# Altium schematic sheet Sheet1.SchDoc
size A4
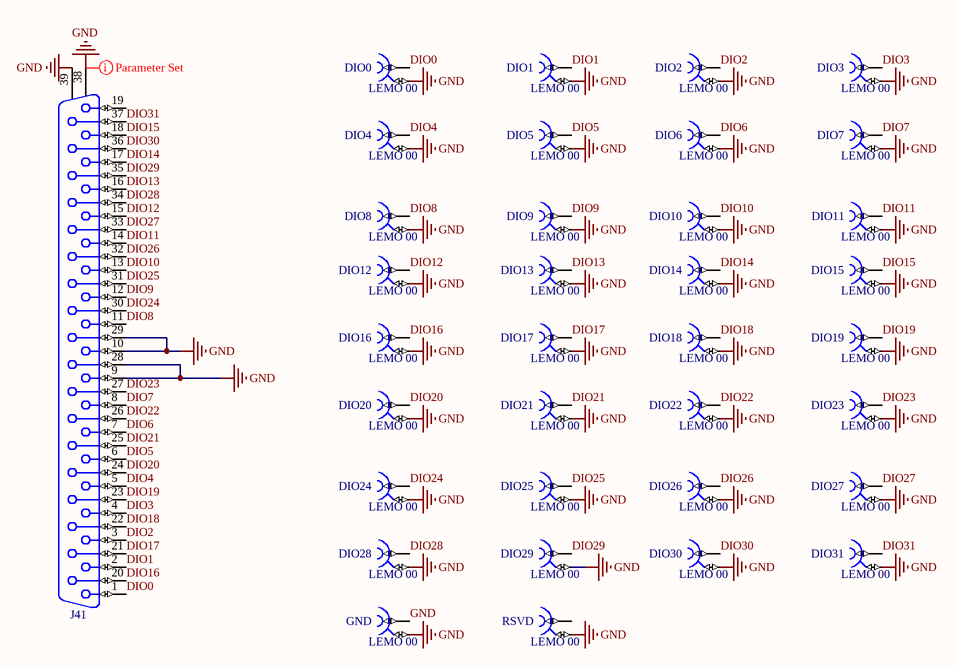
[diagram p0: Sheet1.SchDoc]

## Parts
DIO0  LEMO 00  [LEMO_EPA.00.250.NTN]
DIO1  LEMO 00  [LEMO_EPA.00.250.NTN]
DIO2  LEMO 00  [LEMO_EPA.00.250.NTN]
DIO3  LEMO 00  [LEMO_EPA.00.250.NTN]
DIO4  LEMO 00  [LEMO_EPA.00.250.NTN]
DIO5  LEMO 00  [LEMO_EPA.00.250.NTN]
DIO6  LEMO 00  [LEMO_EPA.00.250.NTN]
DIO7  LEMO 00  [LEMO_EPA.00.250.NTN]
DIO8  LEMO 00  [LEMO_EPA.00.250.NTN]
DIO9  LEMO 00  [LEMO_EPA.00.250.NTN]
DIO10  LEMO 00  [LEMO_EPA.00.250.NTN]
DIO11  LEMO 00  [LEMO_EPA.00.250.NTN]
DIO12  LEMO 00  [LEMO_EPA.00.250.NTN]
DIO13  LEMO 00  [LEMO_EPA.00.250.NTN]
DIO14  LEMO 00  [LEMO_EPA.00.250.NTN]
DIO15  LEMO 00  [LEMO_EPA.00.250.NTN]
DIO16  LEMO 00  [LEMO_EPA.00.250.NTN]
DIO17  LEMO 00  [LEMO_EPA.00.250.NTN]
DIO18  LEMO 00  [LEMO_EPA.00.250.NTN]
DIO19  LEMO 00  [LEMO_EPA.00.250.NTN]
DIO20  LEMO 00  [LEMO_EPA.00.250.NTN]
DIO21  LEMO 00  [LEMO_EPA.00.250.NTN]
DIO22  LEMO 00  [LEMO_EPA.00.250.NTN]
DIO23  LEMO 00  [LEMO_EPA.00.250.NTN]
DIO24  LEMO 00  [LEMO_EPA.00.250.NTN]
DIO25  LEMO 00  [LEMO_EPA.00.250.NTN]
DIO26  LEMO 00  [LEMO_EPA.00.250.NTN]
DIO27  LEMO 00  [LEMO_EPA.00.250.NTN]
DIO28  LEMO 00  [LEMO_EPA.00.250.NTN]
DIO29  LEMO 00  [LEMO_EPA.00.250.NTN]
DIO30  LEMO 00  [LEMO_EPA.00.250.NTN]
DIO31  LEMO 00  [LEMO_EPA.00.250.NTN]
GND  LEMO 00  [LEMO_EPA.00.250.NTN]
J41  D-SUB37F  [NORCOMP_172-037-242R011]  (value not drawn)
RSVD  LEMO 00  [LEMO_EPA.00.250.NTN]

## Nets
GND: DIO0.2 DIO1.2 DIO2.2 DIO3.2 DIO4.2 DIO5.2 DIO6.2 DIO7.2 DIO8.2 DIO9.2 DIO10.2 DIO11.2 DIO12.2 DIO13.2 DIO14.2 DIO15.2 DIO16.2 DIO17.2 DIO18.2 DIO19.2 DIO20.2 DIO21.2 DIO22.2 DIO23.2 DIO24.2 DIO25.2 DIO26.2 DIO27.2 DIO28.2 DIO29.2 DIO30.2 DIO31.2 GND.1 GND.2 J41.9 J41.10 J41.28 J41.29 J41.38 J41.39 RSVD.2
DIO0: DIO0.1 J41.1
DIO1: DIO1.1 J41.2
DIO2: DIO2.1 J41.3
DIO3: DIO3.1 J41.4
DIO4: DIO4.1 J41.5
DIO5: DIO5.1 J41.6
DIO6: DIO6.1 J41.7
DIO7: DIO7.1 J41.8
DIO8: DIO8.1 J41.11
DIO9: DIO9.1 J41.12
DIO10: DIO10.1 J41.13
DIO11: DIO11.1 J41.14
DIO12: DIO12.1 J41.15
DIO13: DIO13.1 J41.16
DIO14: DIO14.1 J41.17
DIO15: DIO15.1 J41.18
DIO16: DIO16.1 J41.20
DIO17: DIO17.1 J41.21
DIO18: DIO18.1 J41.22
DIO19: DIO19.1 J41.23
DIO20: DIO20.1 J41.24
DIO21: DIO21.1 J41.25
DIO22: DIO22.1 J41.26
DIO23: DIO23.1 J41.27
DIO24: DIO24.1 J41.30
DIO25: DIO25.1 J41.31
DIO26: DIO26.1 J41.32
DIO27: DIO27.1 J41.33
DIO28: DIO28.1 J41.34
DIO29: DIO29.1 J41.35
DIO30: DIO30.1 J41.36
DIO31: DIO31.1 J41.37

Not connected (* = marked no-connect by the designer): J41 19; RSVD 1

## Layout directives
rule Routing Layers [TopLayer - DisabledBottomLayer - Enabled ]: GND

## Library data of the parts
DIO0-DIO31 GND RSVD = LEMO_EPA.00.250.NTN: Part Description: Size 00, 50 Ohms Coaxial Straight socket; PressFit: No; SCEM: 09.46.11.184.2; Part Number: LEMO_EPA.00.250.NTN; Component Kind: Standard; Component Type: Standard; Pin Count: 2; Family: LEMO 00; Mounted: Yes; Socket: No; SMD: No; Sense: No; Status: None; Manufacturer: LEMO; Manufacturer Part Number: EPA.00.250.NTN; ComponentHeight: 14mm; HelpURL: \\cern.ch\dfs\Applications\Altium\Datasheets\LEMO_EPA.00.250.NTN.pdf; Author: CERN DEM JLC; CreateDate: 22/04/2008; LatestRevisionDate: 22/04/2008
J41 = NORCOMP_172-037-242R011: Connector D-sub 37 Female; Part Description: Straight Wire Wrap D-Sub 37 Contacts Female Connector With 0.065"Clinch Nut (Board Side); PressFit: No; Part Number: NORCOMP_172-037-242R011; Component Kind: Standard; Component Type: Standard; Pin Count: 39; Family: D-SUB37F; Mounted: Yes; Socket: No; SMD: No; Sense: No; Status: None; Manufacturer: NORCOMP; Manufacturer Part Number: 172-037-242R011; ComponentHeight: 12.08mm; HelpURL: \\cern.ch\dfs\Applications\Altium\Datasheets\NORCOMP_172-037-242R011.pdf; Author: CERN DEM MR; CreateDate: 24/03/2016; LatestRevisionDate: 24/03/2016